# EAGLE design SparkFun_DC-DC_Converter_Breakout (EAGLE 7.4.0)
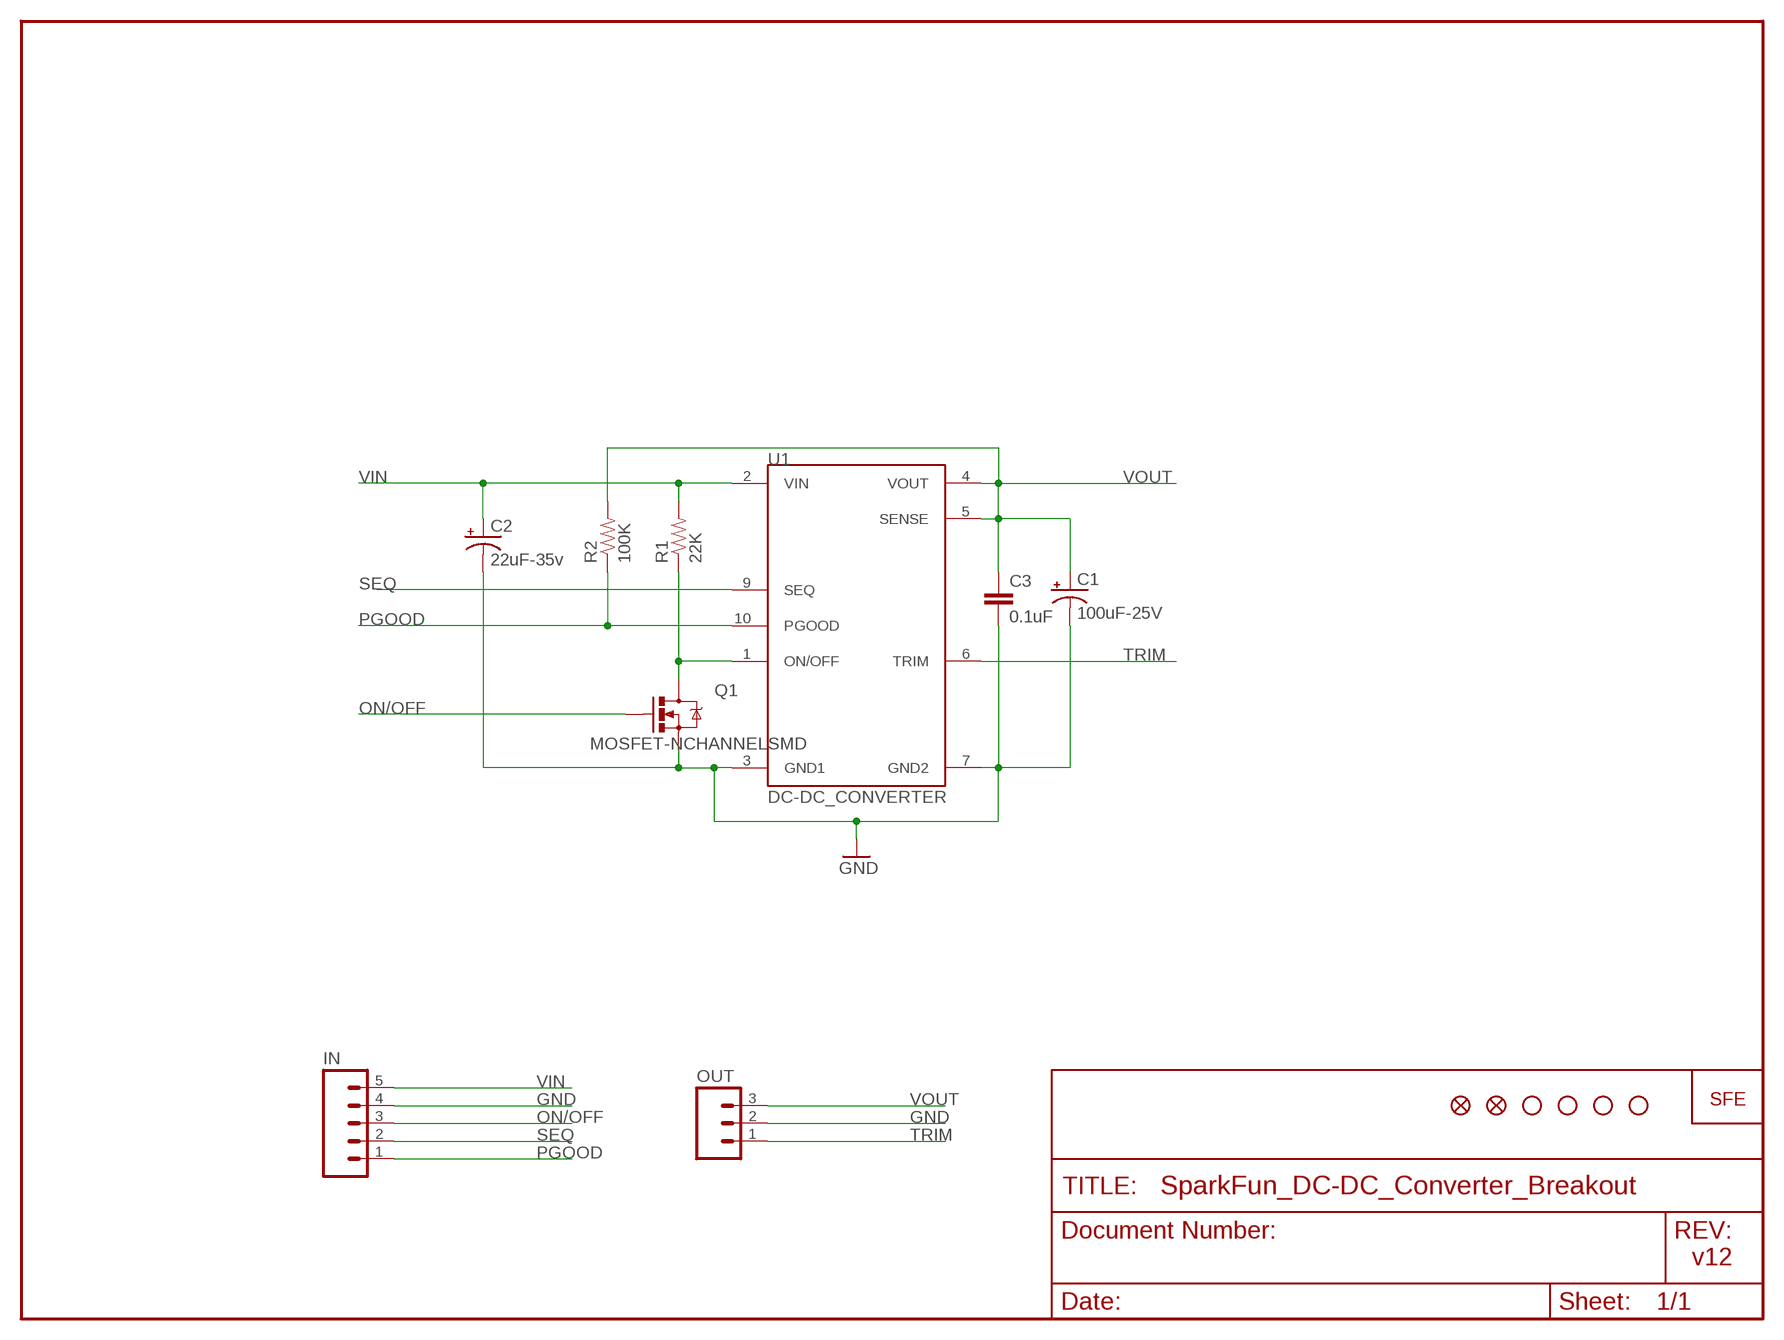
[diagram p0: schematic, sheet 1]

## Parts
C1  100uF-25V  CAP_POL  [NIPPON_F80]
C2  22uF-35v  CAP_POLC  [PANASONIC_C]
C3  0.1uF  CAP0603-CAP  [0603-CAP]
FID1  FIDUCIAL1X2  [FIDUCIAL-1X2]
FID2  FIDUCIAL1X2  [FIDUCIAL-1X2]
IN  M05PTH  [1X05]
OUT  M03PTH  [1X03]
Q1  MOSFET-NCHANNELSMD  [SOT23-3]
R1  22K  RESISTOR0603-RES  [0603-RES]
R2  100K  RESISTOR0603-RES  [0603-RES]
U1  DC-DC_CONVERTER  [DC-DC_CONVERTER]
U$1  STAND-OFF  [STAND-OFF]
U$2  LOGO-SFENEW  [SFE-NEW-WEBLOGO]
U$3  STAND-OFF  [STAND-OFF]
U$4  STAND-OFF  [STAND-OFF]
U$5  STAND-OFF  [STAND-OFF]

## Nets
GND: C1.- C2.- C3.2 IN.4 OUT.2 Q1.2(S) U1.3(GND1) U1.7(GND2)
N$1: Q1.3(D) R1.1 U1.1(ON/OFF)
ON/OFF: IN.3 Q1.1(G)
PGOOD: IN.1 R2.1 U1.10(PGOOD)
SEQ: IN.2 U1.9(SEQ)
TRIM: OUT.1 U1.6(TRIM)
VIN: C2.+ IN.5 R1.2 U1.2(VIN)
VOUT: C1.+ C3.1 OUT.3 R2.2 U1.4(VOUT) U1.5(SENSE)

## Notes on the sheet
- v12

## Library data of the parts
C1 C2 = SparkFun:CAP_POL: Capacitor Polarized These are standard SMD and PTH capacitors. Normally 10uF, 47uF, and 100uF in electrolytic and tantalum varieties. Always verify the external diameter of the through hole cap, it varies with capacity, voltage, and manufacturer. The EIA devices should be standard.
C3 = SparkFun:CAP: Capacitor Standard 0603 ceramic capacitor, and 0.1" leaded capacitor.
FID1 FID2 = SparkFun-Aesthetics:FIDUCIAL: Fiducial Alignment Points Various fiducial points for machine vision alignment.
IN = SparkFun:M05: Header 5 Standard 5-pin 0.1" header. Use with straight break away headers (SKU : PRT-00116), right angle break away headers (PRT-00553), swiss pins (PRT-00743), machine pins (PRT-00117), and female headers (PRT-00115). Molex polarized connector foot print use with SKU : PRT-08230 with associated crimp pins and housings.
OUT = SparkFun:M03: Header 3 Standard 3-pin 0.1" header. Use with straight break away headers (SKU : PRT-00116), right angle break away headers (PRT-00553), swiss pins (PRT-00743), machine pins (PRT-00117), and female headers (PRT-00115). Molex polarized connector foot print use with SKU : PRT-08232 with associated crimp pins and housings.
Q1 = SparkFun:MOSFET-NCHANNEL
R1 R2 = SparkFun:RESISTOR: Resistor Basic schematic elements and footprints for 0603, 1206, and PTH 1/10th watt (small) resistors.
U1 = SparkFun:DC-DC_CONVERTER
U$1 U$3-U$5 = SparkFun:STAND-OFF: Stand Off This is the mechanical footprint for a #4 phillips button head screw. Use the keepout ring to avoid running the screw head into surrounding components. SKU : PRT-00447
U$2 = SparkFun:LOGO-SFE: Spark Fun Electronics PCB Logo This is the standard Spark Fun Electronics PCB logo.

## Board
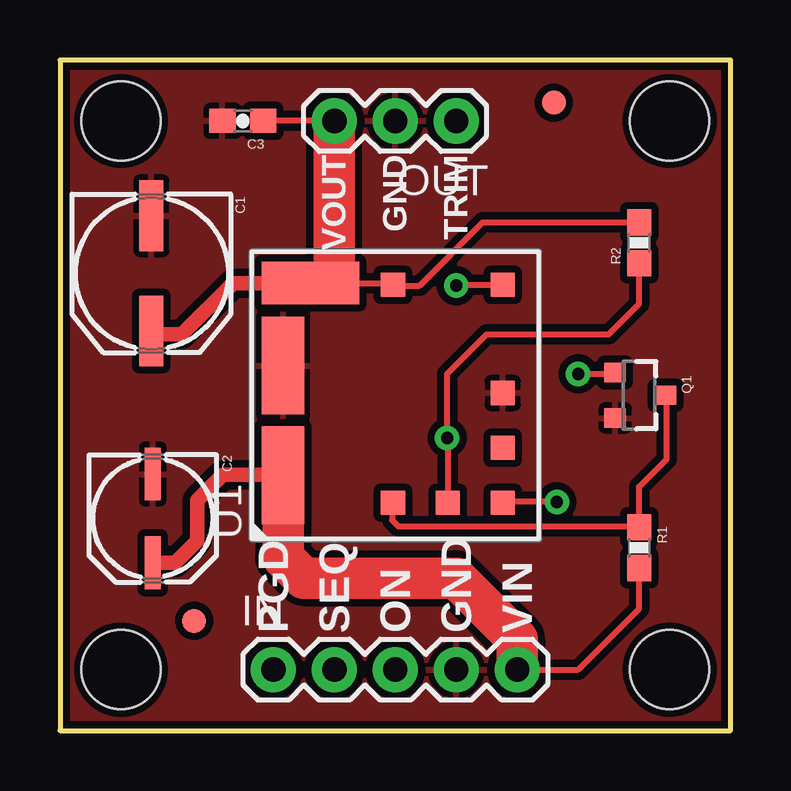
[diagram p1: board, top side]
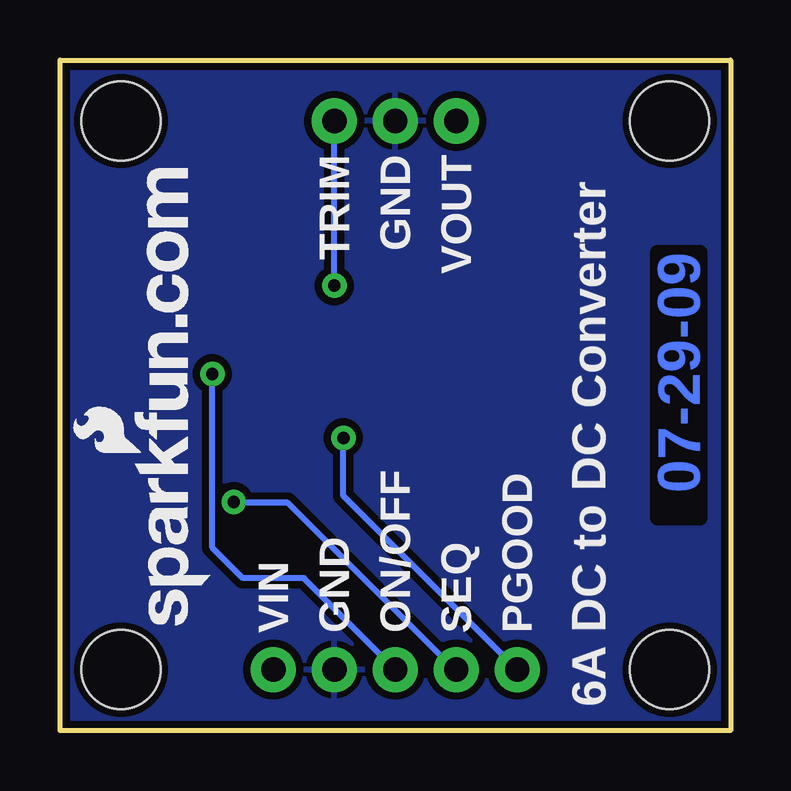
[diagram p2: board, bottom side, seen from below]

Size 27.94 x 27.94 mm. Coordinates in mm from the lower left corner, seen from the top.
Outline: 0,0 27.94,0 27.94,27.94 0,27.94 0,0
Copper layers (1*16): Top 0.035mm / dielectric 1.5mm / Bottom 0.035mm
Design rules "SparkFun": minimum track width 8mil, minimum drill 20mil, track to track 8mil, track to pad 8mil, pad to pad 8mil, via to via 8mil, smd to smd 8mil, copper to edge 10mil, drill to drill 8mil, minimum pad ring 12mil, minimum via ring 10mil, stop-mask expansion 4mil, vias tented up to drill 25mil, thermal gap 10mil

### Footprints (pad centres in the part's own frame; a part is rotated, then mirrored left to right if it is on the bottom)
NIPPON_F80 = smd 2.95 x 1: + 2.4,0; - -2.4,0
PANASONIC_C = smd 2.2 x 0.65: + 1.9,-0.2; - -1.8,-0.2
0603-CAP = smd 1.1 x 1: 1 -0.85,0; 2 0.85,0
FIDUCIAL-1X2 = smd 1 x 1: 1 0,0
1X05 = drill 1.016 pad 1.88: 1 0,0; 2 2.54,0; 3 5.08,0; 4 7.62,0; 5 10.16,0
1X03 = drill 1.016 pad 1.88: 1 0,0; 2 2.54,0; 3 5.08,0
SOT23-3 = smd 0.8 x 0.9: 1 -0.95,-1; 2 0.95,-1; 3 0,1.1
0603-RES = smd 1.1 x 1: 1 -0.85,0; 2 0.85,0
DC-DC_CONVERTER = smd 1.01 x 1.01: 1 -4.48,0.1; 5 4.61,0.1; 6 4.61,-4.48; 7 0.1,-4.48; 8 -2.19,-4.48; 9 -4.48,-4.48; 10 -4.48,-2.19 | smd 4.07 x 1.77: 2 -3.33,4.67; 3 1.24,4.67 | smd 1.77 x 4.07: 4 4.67,3.53
STAND-OFF = hole 3.302: 0,0

### Placement (x,y rotation side)
C1  3.81,19.05 270 top
C2  4.06,8.89 270 top
C3  7.62,25.4 180 top
FID1  20.57,26.16 0 top
FID2  5.59,4.57 0 top
IN  8.89,2.54 0 top
OUT  16.51,25.4 180 top
Q1  24.13,13.97 270 top
R1  24.13,7.62 270 top
R2  24.13,20.32 90 top
U1  13.97,13.97 90 top
U$1  2.54,2.54 0 top
U$2  21.69,4.39 90 bottom
U$3  25.4,2.54 0 top
U$4  2.54,25.4 0 top
U$5  25.4,25.4 0 top

### Tracks (layer width: path | path; a pad name or v marks a point on that pad's centre or on a via)
GND
  pour Top (isolate 0.305): 0,27.94 27.94,27.94 27.94,0 0,0
  pour Bottom (isolate 0.305): 0,0 27.94,0 27.94,27.94 0,27.94
N$1
  Top 0.203: 24.09,8.51 R1.1
  Top 0.254: R1.1 24.13,10.16 25.27,11.3 25.27,13.67 Q1.3 | 24.09,8.51 14.1,8.51 13.84,8.76 13.84,9.46 U1.1
ON/OFF  (via drill 0.51)
  Top 0.254: v21.59,14.86 23.07,14.86 Q1.1
  Bottom 0.254: IN.3 17.78,6.35 20.32,6.35 21.59,7.62 v21.59,14.86
PGOOD  (via drill 0.51)
  Top 0.254: 24.09,19.43 R2.1 24.13,17.78 22.86,16.51 17.78,16.51 16.13,14.86 v16.13,12.19 16.16,12.16 U1.10
  Bottom 0.254: IN.1 16.13,9.78 v16.13,12.19
SEQ  (via drill 0.51)
  Top 0.254: v20.7,9.53 18.48,9.53 U1.9
  Bottom 0.254: 11.43,2.56 IN.2 11.5,2.54 U1.9 20.67,9.49 v20.7,9.53
TRIM  (via drill 0.51)
  Top 0.254: U1.6 16.55,18.58 v16.51,18.54
  Bottom 0.254: v16.51,18.54 OUT.1
VIN
  Top 0.254: R1.2 24.13,5.08 21.59,2.54 IN.5
  Top 0.61: C2.+ 4.81,6.99 5.71,7.9 5.71,9.6 6.78,10.67 8.89,10.67 U1.2
  Top 1.727: 9.3,11.43 U1.2 9.3,7.21 10.16,6.35 16.51,6.35 19.05,3.81 IN.5
VOUT
  Top 0.254: R2.2 17.61,21.17 14.99,18.54 13.91,18.54 U1.5 13.81,18.64 11.84,18.64 11.43,19.05 | OUT.3 C3.1
  Top 0.61: U1.4 7.21,18.64 5.08,16.51 3.95,16.51 C1.+
  Top 1.727: U1.4 11.43,18.77 11.43,19.05 OUT.3

### Text on the board
Bottom: 07-29-09
tPlace: VOUT | GND | TRIM | PGD | SEQ | ON | GND | VIN
bPlace: VOUT | GND | TRIM | PGOOD | SEQ | ON/OFF | GND | VIN | 6A DC to DC Converter